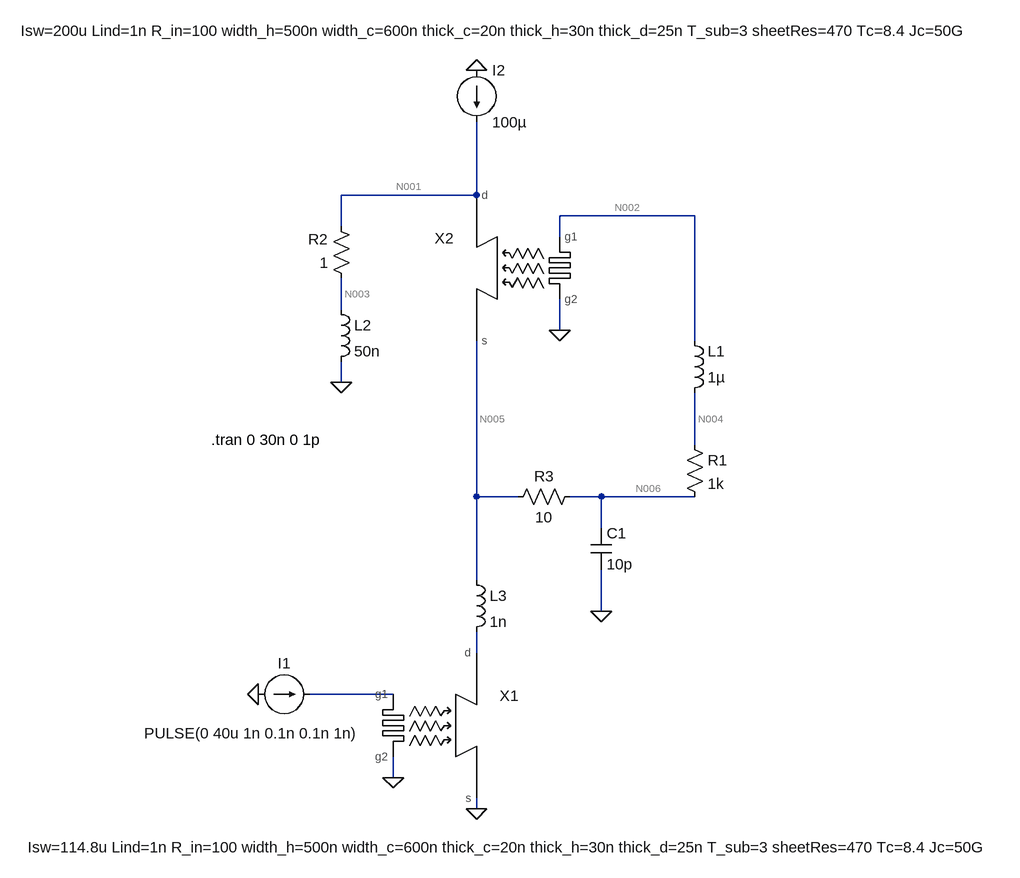
[diagram p0: schematic hTron_to_hTron__reset.asc]
hTron_to_hTron__reset.asc, the LTspice schematic file:
Version 4
SHEET 1 1196 832
WIRE 288 -448 288 -560
WIRE 288 -448 80 -448
WIRE 624 -416 416 -416
WIRE 80 -400 80 -448
WIRE 416 -384 416 -416
WIRE 80 -272 80 -320
WIRE 416 -240 416 -288
WIRE 624 -224 624 -416
WIRE 80 -160 80 -192
WIRE 624 -64 624 -144
WIRE 288 16 288 -224
WIRE 352 16 288 16
WIRE 480 16 432 16
WIRE 624 16 480 16
WIRE 480 64 480 16
WIRE 288 144 288 16
WIRE 480 192 480 128
WIRE 288 256 288 224
WIRE 160 320 32 320
WIRE 160 448 160 416
WIRE 288 496 288 480
FLAG -48 320 0
FLAG 288 -640 0
FLAG 160 448 0
FLAG 288 496 0
FLAG 480 192 0
FLAG 416 -240 0
FLAG 80 -160 0
SYMBOL hTron_debug 288 368 R0
WINDOW 39 57 203 Bottom 2
SYMATTR SpiceLine Isw=114.8u Lind=1n R_in=100 width_h=500n width_c=600n thick_c=20n thick_h=30n thick_d=25n T_sub=3 sheetRes=470 Tc=8.4 Jc=50G
SYMATTR InstName X1
SYMBOL current -48 320 R270
WINDOW 0 32 40 VTop 2
WINDOW 3 -44 -10 VBottom 2
WINDOW 123 0 0 Left 0
WINDOW 39 0 0 Left 0
SYMATTR InstName I1
SYMATTR Value PULSE(0 40u 1n 0.1n 0.1n 1n)
SYMBOL current 288 -640 R0
WINDOW 123 0 0 Left 0
WINDOW 39 0 0 Left 0
SYMATTR InstName I2
SYMATTR Value 100µ
SYMBOL res 608 -80 R0
SYMATTR InstName R1
SYMATTR Value 1k
SYMBOL cap 464 64 R0
SYMATTR InstName C1
SYMATTR Value 10p
SYMBOL ind 608 -128 M180
WINDOW 0 36 80 Left 2
WINDOW 3 36 40 Left 2
SYMATTR InstName L1
SYMATTR Value 1µ
SYMBOL hTron_debug 288 -336 M0
WINDOW 39 -36 -349 Bottom 2
SYMATTR SpiceLine Isw=200u Lind=1n R_in=100 width_h=500n width_c=600n thick_c=20n thick_h=30n thick_d=25n T_sub=3 sheetRes=470 Tc=8.4 Jc=50G
SYMATTR InstName X2
SYMBOL res 96 -304 R180
WINDOW 0 36 76 Left 2
WINDOW 3 36 40 Left 2
SYMATTR InstName R2
SYMATTR Value 1
SYMBOL ind 64 -288 R0
SYMATTR InstName L2
SYMATTR Value 50n
SYMBOL ind 272 128 R0
SYMATTR InstName L3
SYMATTR Value 1n
SYMBOL res 448 0 R90
WINDOW 0 0 56 VBottom 2
WINDOW 3 32 56 VTop 2
SYMATTR InstName R3
SYMATTR Value 10
TEXT -120 -72 Left 2 !.tran 0 30n 0 1p

The netlist it stands for:
* hTron_to_hTron__reset.asc
XX1 N007 N008 0 0 hTron_debug params: hTron_debug Isw=114.8u Lind=1n R_in=100 width_h=500n width_c=600n thick_c=20n thick_h=30n thick_d=25n T_sub=3 sheetRes=470 Tc=8.4 Jc=50G  ; pins d g1 g2 s
I1 0 N008 PULSE(0 40u 1n 0.1n 0.1n 1n)
I2 0 N001 100µ
R1 N004 N006 1k
C1 N006 0 10p
L1 N004 N002 1µ
XX2 N001 N002 0 N005 hTron_debug params: hTron_debug Isw=200u Lind=1n R_in=100 width_h=500n width_c=600n thick_c=20n thick_h=30n thick_d=25n T_sub=3 sheetRes=470 Tc=8.4 Jc=50G  ; pins d g1 g2 s
R2 N003 N001 1
L2 N003 0 50n
L3 N005 N007 1n
R3 N006 N005 10
.tran 0 30n 0 1p
.backanno
.end

* Results of the author's LTspice run, read from the files saved beside the schematic
* Operating Point, zero values left out:
*   V(n001) = 99.9 nV
*   V(n004) = 9 nV
*   V(n006) = 99 nV
*   V(n002) = 9 nV
*   V(n005) = 99.9 nV
*   V(n003) = 99.8 pV
*   I(L3) = 99.9 µA
*   I(L2) = 99.8 nA
*   I(L1) = 90 pA
*   I(I2) = 100 µA
*   I(R3) = -90 pA
*   I(R2) = -99.8 nA
*   I(R1) = -90 pA
*   Ix(x1:D) = 99.9 µA
*   Ix(x1:S) = -99.9 µA
*   Ix(x2:D) = 99.9 µA
*   Ix(x2:G1) = 90 pA
*   Ix(x2:G2) = -90 pA
*   Ix(x2:S) = -99.9 µA
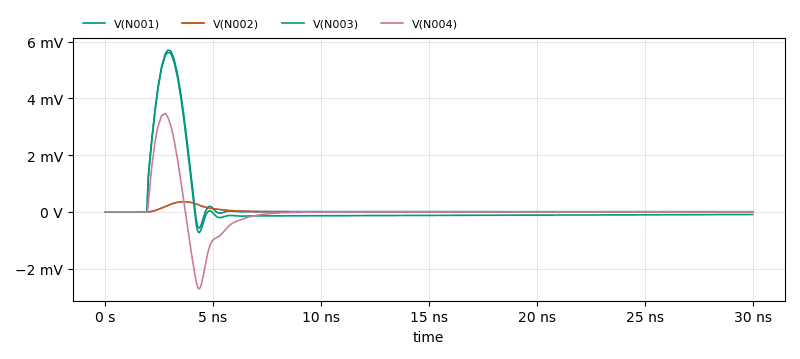
[diagram p1: Transient Analysis of hTron_to_hTron__reset.asc, plotted from the saved traces]
* Transient Analysis, 1 run:
*   V(N001): min -569.4 µV, max 5.688 mV, average 278.3 µV, rms 1.115 mV, last 5.568 µV
*   V(N002): min 9 nV, max 360.5 µV, average 25.42 µV, rms 78.29 µV, last 340.7 nV
*   V(N003): min -729.8 µV, max 5.614 mV, average 162.9 µV, rms 1.101 mV, last -92.61 µV
*   V(N004): min -2.709 mV, max 3.461 mV, average 24.92 µV, rms 722.9 µV, last 278 nV